# Altium schematic sheet main.SchDoc
size A4; SheetNumber: 1; SheetTotal: 2
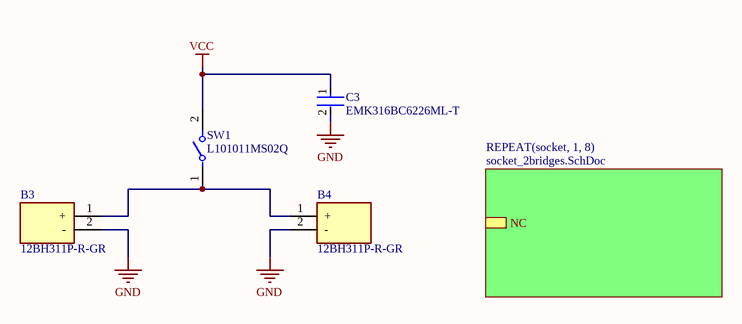
[diagram p0: main.SchDoc]

## Parts
B3  12BH311P-R-GR  [12BH311PRGR]
B4  12BH311P-R-GR  [12BH311PRGR]
C3  EMK316BC6226ML-T  [FP-1206-L_3_2_0_3-W_1_6_0-IPC_A]
SW1  L101011MS02Q  [FP-L101011MS02Q-MFG]

## Sub-sheets
REPEAT(socket, 1, 8) = socket_2bridges.SchDoc: NC

## Nets
GND: B3.2(-) B4.2(-) C3.2
VCC: C3.1 SW1.2
NetB3_1: B3.1(+) B4.1(+) SW1.1

## Library data of the parts
B3 B4 = 12BH311P-R-GR: Cylindrical Battery Contacts, Clips, Holders & Springs 1 "AA" PC LDS W/RIB; Manufacturer_Name: Eagle Plastic Devices; Geometry.Height: 14.4mm; Mouser Part Number: 12BH311P-R-GR; Mouser Price/Stock: https://www.mouser.co.uk/ProductDetail/Eagle-Plastic-Devices/12BH311P-R-GR?qs=xlWIvxljzP5Z0EAaeyyPGg%3D%3D; Manufacturer_Part_Number: 12BH311P-R-GR; Datasheet Link: *
C3 = CMP-14477-000320-2: None; Tolerance: 20%; Voltage Rating: 16V; Capacitance: 22uF; Dielectric: X6S; Case Code (Imperial): 1206; Length: 0.126inch; Mount: Surface Mount; Thickness: 0.071inch; Width: 0.063inch; Lead Free: Lead Free; Case Code (Metric): 3216; Max Operating Temperature: 105°C; Case/Package: 1206; Min Operating Temperature: -55°C; Packaging: Tape and Reel
SW1 = CMP-10038-000020-1: SWITCH SLIDE SPST 4A 125V; Actuator Length: 5.08mm; Actuator Type: Standard; Contact Current Rating: 2A; Electrical Life: 10000Cycles; Switch Function: On-Off; Voltage Rating (DC): 28V; Actuator Color: Black; Actuator Material: Nylon; Switch Travel: 3.81mm; Max Voltage Rating (AC): 250V; Max Current Rating: 4A; Contact Plating: Silver; Throw Configuration: SPST; Depth: 10.8mm; Package Quantity: 1; Length: 19.1mm; Current Rating: 4A; Max Operating Temperature: 65°C; Orientation: Straight; Radiation Hardening: No; Termination: PC Pins; Max Voltage Rating (DC): 125V; Series: L; Min Operating Temperature: -30°C; Contact Material: Copper; Lead Free: Lead Free; Mount: Through Hole; RoHS Compliant: Yes; Voltage Rating (AC): 125V; Packaging: Bulk; Housing Material: Nylon